# Altium schematic sheet ADC_Buffers.SchDoc
size A3
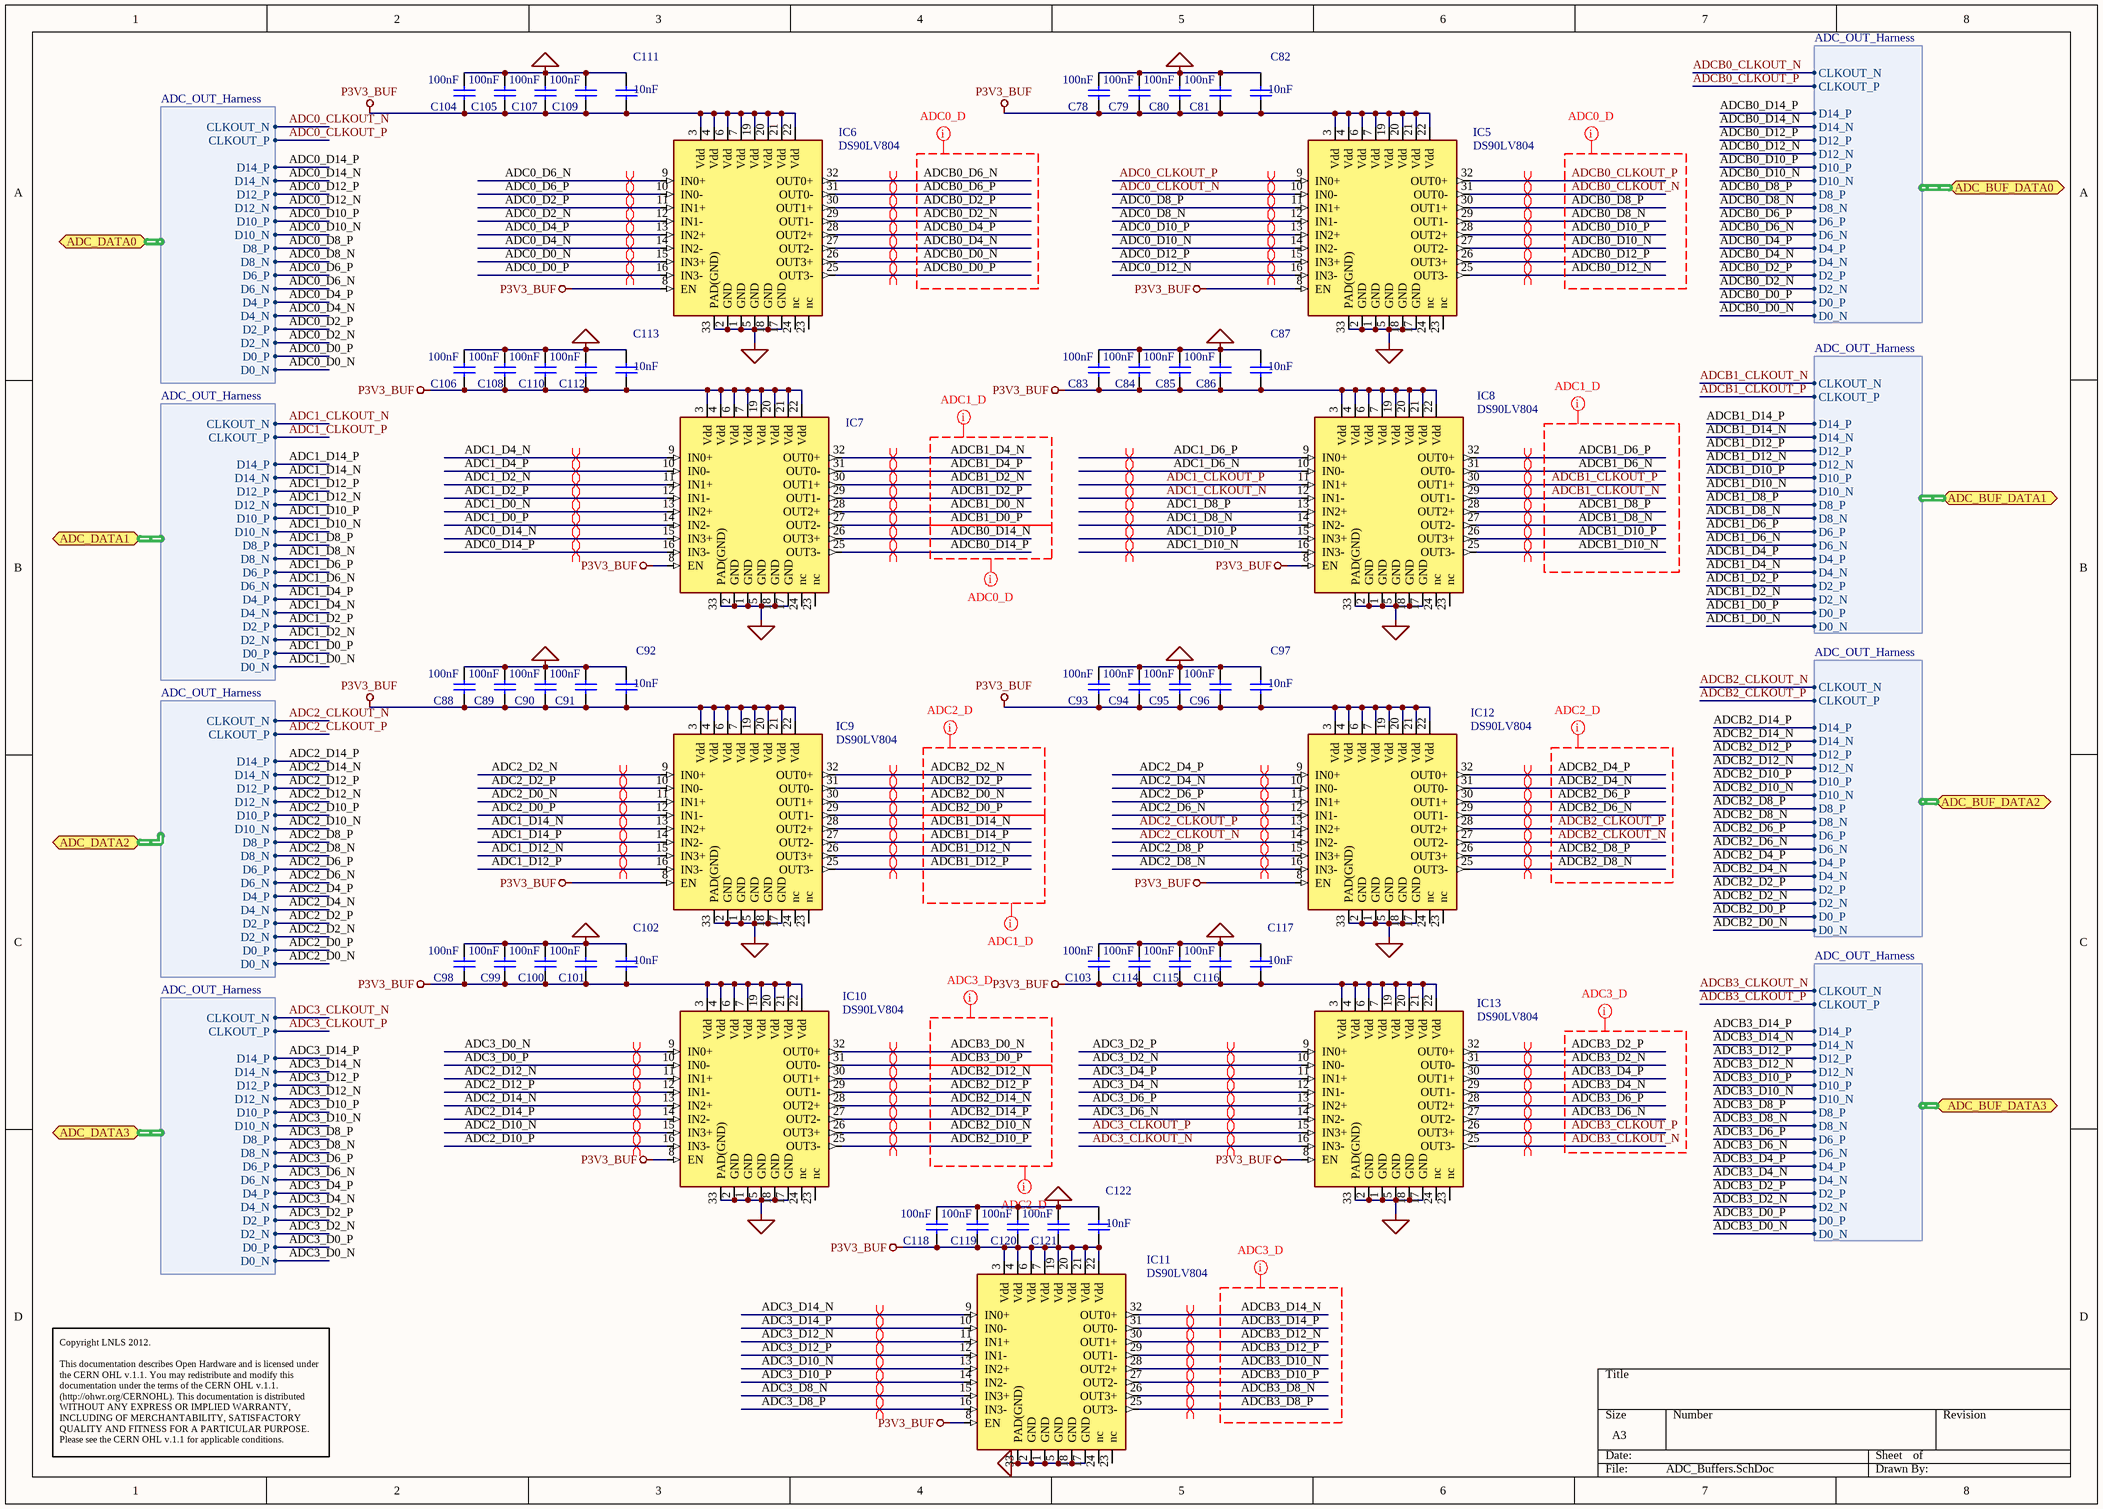
[diagram p0: ADC_Buffers.SchDoc]

## Parts
C78  100nF  [CAPC0603X33N]
C79  100nF  [CAPC0603X33N]
C80  100nF  [CAPC0603X33N]
C81  100nF  [CAPC0603X33N]
C82  10nF  [CAPC0603X33N]
C83  100nF  [CAPC0603X33N]
C84  100nF  [CAPC0603X33N]
C85  100nF  [CAPC0603X33N]
C86  100nF  [CAPC0603X33N]
C87  10nF  [CAPC0603X33N]
C88  100nF  [CAPC0603X33N]
C89  100nF  [CAPC0603X33N]
C90  100nF  [CAPC0603X33N]
C91  100nF  [CAPC0603X33N]
C92  10nF  [CAPC0603X33N]
C93  100nF  [CAPC0603X33N]
C94  100nF  [CAPC0603X33N]
C95  100nF  [CAPC0603X33N]
C96  100nF  [CAPC0603X33N]
C97  10nF  [CAPC0603X33N]
C98  100nF  [CAPC0603X33N]
C99  100nF  [CAPC0603X33N]
C100  100nF  [CAPC0603X33N]
C101  100nF  [CAPC0603X33N]
C102  10nF  [CAPC0603X33N]
C103  100nF  [CAPC0603X33N]
C104  100nF  [CAPC0603X33N]
C105  100nF  [CAPC0603X33N]
C106  100nF  [CAPC0603X33N]
C107  100nF  [CAPC0603X33N]
C108  100nF  [CAPC0603X33N]
C109  100nF  [CAPC0603X33N]
C110  100nF  [CAPC0603X33N]
C111  10nF  [CAPC0603X33N]
C112  100nF  [CAPC0603X33N]
C113  10nF  [CAPC0603X33N]
C114  100nF  [CAPC0603X33N]
C115  100nF  [CAPC0603X33N]
C116  100nF  [CAPC0603X33N]
C117  10nF  [CAPC0603X33N]
C118  100nF  [CAPC0603X33N]
C119  100nF  [CAPC0603X33N]
C120  100nF  [CAPC0603X33N]
C121  100nF  [CAPC0603X33N]
C122  10nF  [CAPC0603X33N]
IC5  DS90LV804  [QFN50P500X500X80-33N-S320]
IC6  DS90LV804  [QFN50P500X500X80-33N-S320]
IC7  DS90LV804  [QFN50P500X500X80-33N-S320]  (value not drawn)
IC8  DS90LV804  [QFN50P500X500X80-33N-S320]
IC9  DS90LV804  [QFN50P500X500X80-33N-S320]
IC10  DS90LV804  [QFN50P500X500X80-33N-S320]
IC11  DS90LV804  [QFN50P500X500X80-33N-S320]
IC12  DS90LV804  [QFN50P500X500X80-33N-S320]
IC13  DS90LV804  [QFN50P500X500X80-33N-S320]

## Ports
ADC_BUF_DATA0 (harness ADC_OUT_Harness), ADC_BUF_DATA1 (harness ADC_OUT_Harness), ADC_BUF_DATA2 (harness ADC_OUT_Harness), ADC_BUF_DATA3 (harness ADC_OUT_Harness), ADC_DATA0 (harness ADC_OUT_Harness), ADC_DATA1 (harness ADC_OUT_Harness), ADC_DATA2 (harness ADC_OUT_Harness), ADC_DATA3 (harness ADC_OUT_Harness)

## Harnesses
ADC_OUT_Harness: D14_P, D14_N, D12_P, D12_N, D10_P, D10_N, D8_P, D8_N, D6_P, D6_N, D4_P, D4_N, D2_P, D2_N, D0_P, D0_N, CLKOUT_N, CLKOUT_P

## Nets
GND: C78.1 C79.1 C80.1 C81.1 C82.1 C83.1 C84.1 C85.1 C86.1 C87.1 C88.1 C89.1 C90.1 C91.1 C92.1 C93.1 C94.1 C95.1 C96.1 C97.1 C98.1 C99.1 C100.1 C101.1 C102.1 C103.1 C104.1 C105.1 C106.1 C107.1 C108.1 C109.1 C110.1 C111.1 C112.1 C113.1 C114.1 C115.1 C116.1 C117.1 C118.1 C119.1 C120.1 C121.1 C122.1 IC5.1(GND) IC5.2(GND) IC5.5(GND) IC5.17(GND) IC5.18(GND) IC5.33(PAD(GND)) IC6.1(GND) IC6.2(GND) IC6.5(GND) IC6.17(GND) IC6.18(GND) IC6.33(PAD(GND)) IC7.1(GND) IC7.2(GND) IC7.5(GND) IC7.17(GND) IC7.18(GND) IC7.33(PAD(GND)) IC8.1(GND) IC8.2(GND) IC8.5(GND) IC8.17(GND) IC8.18(GND) IC8.33(PAD(GND)) IC9.1(GND) IC9.2(GND) IC9.5(GND) IC9.17(GND) IC9.18(GND) IC9.33(PAD(GND)) IC10.1(GND) IC10.2(GND) IC10.5(GND) IC10.17(GND) IC10.18(GND) IC10.33(PAD(GND)) IC11.1(GND) IC11.2(GND) IC11.5(GND) IC11.17(GND) IC11.18(GND) IC11.33(PAD(GND)) IC12.1(GND) IC12.2(GND) IC12.5(GND) IC12.17(GND) IC12.18(GND) IC12.33(PAD(GND)) IC13.1(GND) IC13.2(GND) IC13.5(GND) IC13.17(GND) IC13.18(GND) IC13.33(PAD(GND))
P3V3_BUF: C78.2 C79.2 C80.2 C81.2 C82.2 C83.2 C84.2 C85.2 C86.2 C87.2 C88.2 C89.2 C90.2 C91.2 C92.2 C93.2 C94.2 C95.2 C96.2 C97.2 C98.2 C99.2 C100.2 C101.2 C102.2 C103.2 C104.2 C105.2 C106.2 C107.2 C108.2 C109.2 C110.2 C111.2 C112.2 C113.2 C114.2 C115.2 C116.2 C117.2 C118.2 C119.2 C120.2 C121.2 C122.2 IC5.3(Vdd) IC5.4(Vdd) IC5.6(Vdd) IC5.7(Vdd) IC5.8(EN) IC5.19(Vdd) IC5.20(Vdd) IC5.21(Vdd) IC5.22(Vdd) IC6.3(Vdd) IC6.4(Vdd) IC6.6(Vdd) IC6.7(Vdd) IC6.8(EN) IC6.19(Vdd) IC6.20(Vdd) IC6.21(Vdd) IC6.22(Vdd) IC7.3(Vdd) IC7.4(Vdd) IC7.6(Vdd) IC7.7(Vdd) IC7.8(EN) IC7.19(Vdd) IC7.20(Vdd) IC7.21(Vdd) IC7.22(Vdd) IC8.3(Vdd) IC8.4(Vdd) IC8.6(Vdd) IC8.7(Vdd) IC8.8(EN) IC8.19(Vdd) IC8.20(Vdd) IC8.21(Vdd) IC8.22(Vdd) IC9.3(Vdd) IC9.4(Vdd) IC9.6(Vdd) IC9.7(Vdd) IC9.8(EN) IC9.19(Vdd) IC9.20(Vdd) IC9.21(Vdd) IC9.22(Vdd) IC10.3(Vdd) IC10.4(Vdd) IC10.6(Vdd) IC10.7(Vdd) IC10.8(EN) IC10.19(Vdd) IC10.20(Vdd) IC10.21(Vdd) IC10.22(Vdd) IC11.3(Vdd) IC11.4(Vdd) IC11.6(Vdd) IC11.7(Vdd) IC11.8(EN) IC11.19(Vdd) IC11.20(Vdd) IC11.21(Vdd) IC11.22(Vdd) IC12.3(Vdd) IC12.4(Vdd) IC12.6(Vdd) IC12.7(Vdd) IC12.8(EN) IC12.19(Vdd) IC12.20(Vdd) IC12.21(Vdd) IC12.22(Vdd) IC13.3(Vdd) IC13.4(Vdd) IC13.6(Vdd) IC13.7(Vdd) IC13.8(EN) IC13.19(Vdd) IC13.20(Vdd) IC13.21(Vdd) IC13.22(Vdd)
ADC0_CLKOUT_N: IC5.10(IN0-) ; port ADC_DATA0.CLKOUT_N
ADC0_CLKOUT_P: IC5.9(IN0+) ; port ADC_DATA0.CLKOUT_P
ADC0_D0_N: IC6.15(IN3+) ; port ADC_DATA0.D0_N
ADC0_D0_P: IC6.16(IN3-) ; port ADC_DATA0.D0_P
ADC0_D2_N: IC6.12(IN1-) ; port ADC_DATA0.D2_N
ADC0_D2_P: IC6.11(IN1+) ; port ADC_DATA0.D2_P
ADC0_D4_N: IC6.14(IN2-) ; port ADC_DATA0.D4_N
ADC0_D4_P: IC6.13(IN2+) ; port ADC_DATA0.D4_P
ADC0_D6_N: IC6.9(IN0+) ; port ADC_DATA0.D6_N
ADC0_D6_P: IC6.10(IN0-) ; port ADC_DATA0.D6_P
ADC0_D8_N: IC5.12(IN1-) ; port ADC_DATA0.D8_N
ADC0_D8_P: IC5.11(IN1+) ; port ADC_DATA0.D8_P
ADC0_D10_N: IC5.14(IN2-) ; port ADC_DATA0.D10_N
ADC0_D10_P: IC5.13(IN2+) ; port ADC_DATA0.D10_P
ADC0_D12_N: IC5.16(IN3-) ; port ADC_DATA0.D12_N
ADC0_D12_P: IC5.15(IN3+) ; port ADC_DATA0.D12_P
ADC0_D14_N: IC7.15(IN3+) ; port ADC_DATA0.D14_N
ADC0_D14_P: IC7.16(IN3-) ; port ADC_DATA0.D14_P
ADC1_CLKOUT_N: IC8.12(IN1-) ; port ADC_DATA1.CLKOUT_N
ADC1_CLKOUT_P: IC8.11(IN1+) ; port ADC_DATA1.CLKOUT_P
ADC1_D0_N: IC7.13(IN2+) ; port ADC_DATA1.D0_N
ADC1_D0_P: IC7.14(IN2-) ; port ADC_DATA1.D0_P
ADC1_D2_N: IC7.11(IN1+) ; port ADC_DATA1.D2_N
ADC1_D2_P: IC7.12(IN1-) ; port ADC_DATA1.D2_P
ADC1_D4_N: IC7.9(IN0+) ; port ADC_DATA1.D4_N
ADC1_D4_P: IC7.10(IN0-) ; port ADC_DATA1.D4_P
ADC1_D6_N: IC8.10(IN0-) ; port ADC_DATA1.D6_N
ADC1_D6_P: IC8.9(IN0+) ; port ADC_DATA1.D6_P
ADC1_D8_N: IC8.14(IN2-) ; port ADC_DATA1.D8_N
ADC1_D8_P: IC8.13(IN2+) ; port ADC_DATA1.D8_P
ADC1_D10_N: IC8.16(IN3-) ; port ADC_DATA1.D10_N
ADC1_D10_P: IC8.15(IN3+) ; port ADC_DATA1.D10_P
ADC1_D12_N: IC9.15(IN3+) ; port ADC_DATA1.D12_N
ADC1_D12_P: IC9.16(IN3-) ; port ADC_DATA1.D12_P
ADC1_D14_N: IC9.13(IN2+) ; port ADC_DATA1.D14_N
ADC1_D14_P: IC9.14(IN2-) ; port ADC_DATA1.D14_P
ADC2_CLKOUT_N: IC12.14(IN2-) ; port ADC_DATA2.CLKOUT_N
ADC2_CLKOUT_P: IC12.13(IN2+) ; port ADC_DATA2.CLKOUT_P
ADC2_D0_N: IC9.11(IN1+) ; port ADC_DATA2.D0_N
ADC2_D0_P: IC9.12(IN1-) ; port ADC_DATA2.D0_P
ADC2_D2_N: IC9.9(IN0+) ; port ADC_DATA2.D2_N
ADC2_D2_P: IC9.10(IN0-) ; port ADC_DATA2.D2_P
ADC2_D4_N: IC12.10(IN0-) ; port ADC_DATA2.D4_N
ADC2_D4_P: IC12.9(IN0+) ; port ADC_DATA2.D4_P
ADC2_D6_N: IC12.12(IN1-) ; port ADC_DATA2.D6_N
ADC2_D6_P: IC12.11(IN1+) ; port ADC_DATA2.D6_P
ADC2_D8_N: IC12.16(IN3-) ; port ADC_DATA2.D8_N
ADC2_D8_P: IC12.15(IN3+) ; port ADC_DATA2.D8_P
ADC2_D10_N: IC10.15(IN3+) ; port ADC_DATA2.D10_N
ADC2_D10_P: IC10.16(IN3-) ; port ADC_DATA2.D10_P
ADC2_D12_N: IC10.11(IN1+) ; port ADC_DATA2.D12_N
ADC2_D12_P: IC10.12(IN1-) ; port ADC_DATA2.D12_P
ADC2_D14_N: IC10.13(IN2+) ; port ADC_DATA2.D14_N
ADC2_D14_P: IC10.14(IN2-) ; port ADC_DATA2.D14_P
ADC3_CLKOUT_N: IC13.16(IN3-) ; port ADC_DATA3.CLKOUT_N
ADC3_CLKOUT_P: IC13.15(IN3+) ; port ADC_DATA3.CLKOUT_P
ADC3_D0_N: IC10.9(IN0+) ; port ADC_DATA3.D0_N
ADC3_D0_P: IC10.10(IN0-) ; port ADC_DATA3.D0_P
ADC3_D2_N: IC13.10(IN0-) ; port ADC_DATA3.D2_N
ADC3_D2_P: IC13.9(IN0+) ; port ADC_DATA3.D2_P
ADC3_D4_N: IC13.12(IN1-) ; port ADC_DATA3.D4_N
ADC3_D4_P: IC13.11(IN1+) ; port ADC_DATA3.D4_P
ADC3_D6_N: IC13.14(IN2-) ; port ADC_DATA3.D6_N
ADC3_D6_P: IC13.13(IN2+) ; port ADC_DATA3.D6_P
ADC3_D8_N: IC11.15(IN3+) ; port ADC_DATA3.D8_N
ADC3_D8_P: IC11.16(IN3-) ; port ADC_DATA3.D8_P
ADC3_D10_N: IC11.13(IN2+) ; port ADC_DATA3.D10_N
ADC3_D10_P: IC11.14(IN2-) ; port ADC_DATA3.D10_P
ADC3_D12_N: IC11.11(IN1+) ; port ADC_DATA3.D12_N
ADC3_D12_P: IC11.12(IN1-) ; port ADC_DATA3.D12_P
ADC3_D14_N: IC11.9(IN0+) ; port ADC_DATA3.D14_N
ADC3_D14_P: IC11.10(IN0-) ; port ADC_DATA3.D14_P
ADCB0_CLKOUT_N: IC5.31(OUT0-) ; port ADC_BUF_DATA0.CLKOUT_N
ADCB0_CLKOUT_P: IC5.32(OUT0+) ; port ADC_BUF_DATA0.CLKOUT_P
ADCB0_D0_N: IC6.26(OUT3+) ; port ADC_BUF_DATA0.D0_N
ADCB0_D0_P: IC6.25(OUT3-) ; port ADC_BUF_DATA0.D0_P
ADCB0_D2_N: IC6.29(OUT1-) ; port ADC_BUF_DATA0.D2_N
ADCB0_D2_P: IC6.30(OUT1+) ; port ADC_BUF_DATA0.D2_P
ADCB0_D4_N: IC6.27(OUT2-) ; port ADC_BUF_DATA0.D4_N
ADCB0_D4_P: IC6.28(OUT2+) ; port ADC_BUF_DATA0.D4_P
ADCB0_D6_N: IC6.32(OUT0+) ; port ADC_BUF_DATA0.D6_N
ADCB0_D6_P: IC6.31(OUT0-) ; port ADC_BUF_DATA0.D6_P
ADCB0_D8_N: IC5.29(OUT1-) ; port ADC_BUF_DATA0.D8_N
ADCB0_D8_P: IC5.30(OUT1+) ; port ADC_BUF_DATA0.D8_P
ADCB0_D10_N: IC5.27(OUT2-) ; port ADC_BUF_DATA0.D10_N
ADCB0_D10_P: IC5.28(OUT2+) ; port ADC_BUF_DATA0.D10_P
ADCB0_D12_N: IC5.25(OUT3-) ; port ADC_BUF_DATA0.D12_N
ADCB0_D12_P: IC5.26(OUT3+) ; port ADC_BUF_DATA0.D12_P
ADCB0_D14_N: IC7.26(OUT3+) ; port ADC_BUF_DATA0.D14_N
ADCB0_D14_P: IC7.25(OUT3-) ; port ADC_BUF_DATA0.D14_P
ADCB1_CLKOUT_N: IC8.29(OUT1-) ; port ADC_BUF_DATA1.CLKOUT_N
ADCB1_CLKOUT_P: IC8.30(OUT1+) ; port ADC_BUF_DATA1.CLKOUT_P
ADCB1_D0_N: IC7.28(OUT2+) ; port ADC_BUF_DATA1.D0_N
ADCB1_D0_P: IC7.27(OUT2-) ; port ADC_BUF_DATA1.D0_P
ADCB1_D2_N: IC7.30(OUT1+) ; port ADC_BUF_DATA1.D2_N
ADCB1_D2_P: IC7.29(OUT1-) ; port ADC_BUF_DATA1.D2_P
ADCB1_D4_N: IC7.32(OUT0+) ; port ADC_BUF_DATA1.D4_N
ADCB1_D4_P: IC7.31(OUT0-) ; port ADC_BUF_DATA1.D4_P
ADCB1_D6_N: IC8.31(OUT0-) ; port ADC_BUF_DATA1.D6_N
ADCB1_D6_P: IC8.32(OUT0+) ; port ADC_BUF_DATA1.D6_P
ADCB1_D8_N: IC8.27(OUT2-) ; port ADC_BUF_DATA1.D8_N
ADCB1_D8_P: IC8.28(OUT2+) ; port ADC_BUF_DATA1.D8_P
ADCB1_D10_N: IC8.25(OUT3-) ; port ADC_BUF_DATA1.D10_N
ADCB1_D10_P: IC8.26(OUT3+) ; port ADC_BUF_DATA1.D10_P
ADCB1_D12_N: IC9.26(OUT3+) ; port ADC_BUF_DATA1.D12_N
ADCB1_D12_P: IC9.25(OUT3-) ; port ADC_BUF_DATA1.D12_P
ADCB1_D14_N: IC9.28(OUT2+) ; port ADC_BUF_DATA1.D14_N
ADCB1_D14_P: IC9.27(OUT2-) ; port ADC_BUF_DATA1.D14_P
ADCB2_CLKOUT_N: IC12.27(OUT2-) ; port ADC_BUF_DATA2.CLKOUT_N
ADCB2_CLKOUT_P: IC12.28(OUT2+) ; port ADC_BUF_DATA2.CLKOUT_P
ADCB2_D0_N: IC9.30(OUT1+) ; port ADC_BUF_DATA2.D0_N
ADCB2_D0_P: IC9.29(OUT1-) ; port ADC_BUF_DATA2.D0_P
ADCB2_D2_N: IC9.32(OUT0+) ; port ADC_BUF_DATA2.D2_N
ADCB2_D2_P: IC9.31(OUT0-) ; port ADC_BUF_DATA2.D2_P
ADCB2_D4_N: IC12.31(OUT0-) ; port ADC_BUF_DATA2.D4_N
ADCB2_D4_P: IC12.32(OUT0+) ; port ADC_BUF_DATA2.D4_P
ADCB2_D6_N: IC12.29(OUT1-) ; port ADC_BUF_DATA2.D6_N
ADCB2_D6_P: IC12.30(OUT1+) ; port ADC_BUF_DATA2.D6_P
ADCB2_D8_N: IC12.25(OUT3-) ; port ADC_BUF_DATA2.D8_N
ADCB2_D8_P: IC12.26(OUT3+) ; port ADC_BUF_DATA2.D8_P
ADCB2_D10_N: IC10.26(OUT3+) ; port ADC_BUF_DATA2.D10_N
ADCB2_D10_P: IC10.25(OUT3-) ; port ADC_BUF_DATA2.D10_P
ADCB2_D12_N: IC10.30(OUT1+) ; port ADC_BUF_DATA2.D12_N
ADCB2_D12_P: IC10.29(OUT1-) ; port ADC_BUF_DATA2.D12_P
ADCB2_D14_N: IC10.28(OUT2+) ; port ADC_BUF_DATA2.D14_N
ADCB2_D14_P: IC10.27(OUT2-) ; port ADC_BUF_DATA2.D14_P
ADCB3_CLKOUT_N: IC13.25(OUT3-) ; port ADC_BUF_DATA3.CLKOUT_N
ADCB3_CLKOUT_P: IC13.26(OUT3+) ; port ADC_BUF_DATA3.CLKOUT_P
ADCB3_D0_N: IC10.32(OUT0+) ; port ADC_BUF_DATA3.D0_N
ADCB3_D0_P: IC10.31(OUT0-) ; port ADC_BUF_DATA3.D0_P
ADCB3_D2_N: IC13.31(OUT0-) ; port ADC_BUF_DATA3.D2_N
ADCB3_D2_P: IC13.32(OUT0+) ; port ADC_BUF_DATA3.D2_P
ADCB3_D4_N: IC13.29(OUT1-) ; port ADC_BUF_DATA3.D4_N
ADCB3_D4_P: IC13.30(OUT1+) ; port ADC_BUF_DATA3.D4_P
ADCB3_D6_N: IC13.27(OUT2-) ; port ADC_BUF_DATA3.D6_N
ADCB3_D6_P: IC13.28(OUT2+) ; port ADC_BUF_DATA3.D6_P
ADCB3_D8_N: IC11.26(OUT3+) ; port ADC_BUF_DATA3.D8_N
ADCB3_D8_P: IC11.25(OUT3-) ; port ADC_BUF_DATA3.D8_P
ADCB3_D10_N: IC11.28(OUT2+) ; port ADC_BUF_DATA3.D10_N
ADCB3_D10_P: IC11.27(OUT2-) ; port ADC_BUF_DATA3.D10_P
ADCB3_D12_N: IC11.30(OUT1+) ; port ADC_BUF_DATA3.D12_N
ADCB3_D12_P: IC11.29(OUT1-) ; port ADC_BUF_DATA3.D12_P
ADCB3_D14_N: IC11.32(OUT0+) ; port ADC_BUF_DATA3.D14_N
ADCB3_D14_P: IC11.31(OUT0-) ; port ADC_BUF_DATA3.D14_P

Not connected (* = marked no-connect by the designer): IC5 23(nc) 24(nc); IC6 23(nc) 24(nc); IC7 23(nc) 24(nc); IC8 23(nc) 24(nc); IC9 23(nc) 24(nc); IC10 23(nc) 24(nc); IC11 23(nc) 24(nc); IC12 23(nc) 24(nc); IC13 23(nc) 24(nc)

## Layout directives
differential pair: ADC0_CLKOUT_N, ADC0_CLKOUT_P, ADC0_D0_N, ADC0_D0_P, ADC0_D2_N, ADC0_D2_P, ADC0_D4_N, ADC0_D4_P, ADC0_D6_N, ADC0_D6_P, ADC0_D8_N, ADC0_D8_P, ADC0_D10_N, ADC0_D10_P, ADC0_D12_N, ADC0_D12_P, ADC0_D14_N, ADC0_D14_P, ADC1_CLKOUT_N, ADC1_CLKOUT_P, ADC1_D0_N, ADC1_D0_P, ADC1_D2_N, ADC1_D2_P, ADC1_D4_N, ADC1_D4_P, ADC1_D6_N, ADC1_D6_P, ADC1_D8_N, ADC1_D8_P, ADC1_D10_N, ADC1_D10_P, ADC1_D12_N, ADC1_D12_P, ADC1_D14_N, ADC1_D14_P, ADC2_CLKOUT_N, ADC2_CLKOUT_P, ADC2_D0_N, ADC2_D0_P, ADC2_D2_N, ADC2_D2_P, ADC2_D4_N, ADC2_D4_P, ADC2_D6_N, ADC2_D6_P, ADC2_D8_N, ADC2_D8_P, ADC2_D10_N, ADC2_D10_P, ADC2_D12_N, ADC2_D12_P, ADC2_D14_N, ADC2_D14_P, ADC3_CLKOUT_N, ADC3_CLKOUT_P, ADC3_D0_N, ADC3_D0_P, ADC3_D2_N, ADC3_D2_P, ADC3_D4_N, ADC3_D4_P, ADC3_D6_N, ADC3_D6_P, ADC3_D8_N, ADC3_D8_P, ADC3_D10_N, ADC3_D10_P, ADC3_D12_N, ADC3_D12_P, ADC3_D14_N, ADC3_D14_P, ADCB0_CLKOUT_N, ADCB0_CLKOUT_P, ADCB0_D0_N, ADCB0_D0_P, ADCB0_D2_N, ADCB0_D2_P, ADCB0_D4_N, ADCB0_D4_P, ADCB0_D6_N, ADCB0_D6_P, ADCB0_D8_N, ADCB0_D8_P, ADCB0_D10_N, ADCB0_D10_P, ADCB0_D12_N, ADCB0_D12_P, ADCB0_D14_N, ADCB0_D14_P, ADCB1_CLKOUT_N, ADCB1_CLKOUT_P, ADCB1_D0_N, ADCB1_D0_P, ADCB1_D2_N, ADCB1_D2_P, ADCB1_D4_N, ADCB1_D4_P, ADCB1_D6_N, ADCB1_D6_P, ADCB1_D8_N, ADCB1_D8_P, ADCB1_D10_N, ADCB1_D10_P, ADCB1_D12_N, ADCB1_D12_P, ADCB1_D14_N, ADCB1_D14_P, ADCB2_CLKOUT_N, ADCB2_CLKOUT_P, ADCB2_D0_N, ADCB2_D0_P, ADCB2_D2_N, ADCB2_D2_P, ADCB2_D4_N, ADCB2_D4_P, ADCB2_D6_N, ADCB2_D6_P, ADCB2_D8_N, ADCB2_D8_P, ADCB2_D10_N, ADCB2_D10_P, ADCB2_D12_N, ADCB2_D12_P, ADCB2_D14_N, ADCB2_D14_P, ADCB3_CLKOUT_N, ADCB3_CLKOUT_P, ADCB3_D0_N, ADCB3_D0_P, ADCB3_D2_N, ADCB3_D2_P, ADCB3_D4_N, ADCB3_D4_P, ADCB3_D6_N, ADCB3_D6_P, ADCB3_D8_N, ADCB3_D8_P, ADCB3_D10_N, ADCB3_D10_P, ADCB3_D12_N, ADCB3_D12_P, ADCB3_D14_N, ADCB3_D14_P
net class ADC2_D: ADCB2_CLKOUT_N, ADCB2_CLKOUT_P, ADCB2_D0_N, ADCB2_D0_P, ADCB2_D2_N, ADCB2_D2_P, ADCB2_D4_N, ADCB2_D4_P, ADCB2_D6_N, ADCB2_D6_P, ADCB2_D8_N, ADCB2_D8_P, ADCB2_D10_N, ADCB2_D10_P, ADCB2_D12_N, ADCB2_D12_P, ADCB2_D14_N, ADCB2_D14_P, ADCB3_D0_P
net class ADC0_D: ADCB0_CLKOUT_N, ADCB0_CLKOUT_P, ADCB0_D0_N, ADCB0_D0_P, ADCB0_D2_N, ADCB0_D2_P, ADCB0_D4_N, ADCB0_D4_P, ADCB0_D6_N, ADCB0_D6_P, ADCB0_D8_N, ADCB0_D8_P, ADCB0_D10_N, ADCB0_D10_P, ADCB0_D12_N, ADCB0_D12_P, ADCB0_D14_N, ADCB0_D14_P, ADCB1_D0_P
net class ADC1_D: ADCB1_CLKOUT_N, ADCB1_CLKOUT_P, ADCB1_D0_N, ADCB1_D0_P, ADCB1_D2_N, ADCB1_D2_P, ADCB1_D4_N, ADCB1_D4_P, ADCB1_D6_N, ADCB1_D6_P, ADCB1_D8_N, ADCB1_D8_P, ADCB1_D10_N, ADCB1_D10_P, ADCB1_D12_N, ADCB1_D12_P, ADCB1_D14_N, ADCB1_D14_P, ADCB2_D0_P
net class ADC3_D: ADCB3_CLKOUT_N, ADCB3_CLKOUT_P, ADCB3_D0_N, ADCB3_D0_P, ADCB3_D2_N, ADCB3_D2_P, ADCB3_D4_N, ADCB3_D4_P, ADCB3_D6_N, ADCB3_D6_P, ADCB3_D8_N, ADCB3_D8_P, ADCB3_D10_N, ADCB3_D10_P, ADCB3_D12_N, ADCB3_D12_P, ADCB3_D14_N, ADCB3_D14_P

## Notes on the sheet
- Copyright LNLS 2012.
  This documentation describes Open Hardware and is licensed under the CERN OHL v.1.1. You may redistribute and modify this documentation under the terms of the CERN OHL v.1.1. (http://ohwr.org/CERNOHL). This documentation is distributed WITHOUT ANY EXPRESS OR IMPLIED WARRANTY, INCLUDING OF MERCHANTABILITY, SATISFACTORY QUALITY AND FITNESS FOR A PARTICULAR PURPOSE. Please see the CERN OHL v.1.1 for applicable conditions.

## Library data of the parts
C78-C81 C83-C86 C88-C91 C93-C96 C98-C101 C103-C110 C112 C114-C116 C118-C121 = CC0201_100NF_6.3V_10%_X5R: Non-polarised capacitor; Part Description: SMD Multilayer Chip Ceramic Capacitor; Manufacturer: GENERIC; Manufacturer1 Part Number: 02016D104KAT2A; Voltage: 6.3V; TC: X5R; Tolerance: ±10%; Table: Capacitors SMD; Value: 100nF; Part Number: CC0201_100NF_6.3V_10%_X5R; Component Kind: Standard; Component Type: Standard; Pin Count: 2; Status: Not Recommended; Manufacturer Part Number: CC0201_100NF_6.3V_10%_X5R; Case: 0201; Mounted: Yes; Socket: No; SMD: Yes; Manufacturer1 Example: AVX; Manufacturer1 ComponentHeight: 0.33mm; HelpURL: \\cern.ch\dfs\Applications\Altium\Datasheets\CC0201_X5R_AVX.pdf; Author: CERN DEM JLC; CreateDate: 03/12/2007; LatestRevisionDate: 03/12/2007; Sense: No
C82 C87 C92 C97 C102 C111 C113 C117 C122 = CC0201_10NF_10V_10%_X7R: Non-polarised capacitor; Part Description: SMD Multilayer Chip Ceramic Capacitor; Manufacturer: GENERIC; Manufacturer1 Part Number: GRM033R71A103KA01D; Voltage: 10V; TC: X7R; Tolerance: ±10%; Value: 10nF; Part Number: CC0201_10NF_10V_10%_X7R; Component Kind: Standard; Component Type: Standard; Pin Count: 2; Status: Not Recommended; Manufacturer Part Number: CC0201_10NF_10V_10%_X7R; Case: 0201; Mounted: Yes; Socket: No; SMD: Yes; Manufacturer1 Example: Murata; Manufacturer1 ComponentHeight: 0.33mm; Author: LNLS DIG GBMB; CreateDate: 14/06/2016; LatestRevisionDate: 14/06/2016; Sense: No
IC5 IC6 = DS90LV804TSQ: 4-Channel 800 Mbps LVDS Buffer/Repeater; Manufacturer: TEXAS INSTRUMENTS; Bonding: No; PressFit: No; Part Number: DS90LV804TSQ; Author: LNLS DIG GBMB; Case: QFN32; ComponentHeight: 0.8mm; Component Type: Standard; CreateDate: 01/06/2016; Device: DS90LV804; LatestRevisionDate: 01/06/2016; Manufacturer Part Number: DS90LV804TSQ; Mounted: Yes; PackageDescription: QFN, 0.50mm Pitch, Square; 8 Pin X 8 Pin, 5mm X 5mm X 0.8mm H Body (w/Thermal Tab 3.2 X 3.2mm),  IPC Medium Density; Part Description: 4-Channel 800Mbps LVDS Buffer/Repeater; Pin Count: 33; Sense: No; SMD: Yes; Socket: No; Component Kind: Standard
IC7-IC13 = DS90LV804TSQ: 4-Channel 800 Mbps LVDS Buffer/Repeater; Manufacturer: TEXAS INSTRUMENTS; PressFit: No; Bonding: No; Part Number: DS90LV804TSQ; Component Kind: Standard; Component Type: Standard; Device: DS90LV804; PackageDescription: QFN, 0.50mm Pitch, Square; 8 Pin X 8 Pin, 5mm X 5mm X 0.8mm H Body (w/Thermal Tab 3.2 X 3.2mm),  IPC Medium Density; Part Description: 4-Channel 800Mbps LVDS Buffer/Repeater; Manufacturer Part Number: DS90LV804TSQ; Pin Count: 33; Case: QFN32; Mounted: Yes; Socket: No; SMD: Yes; Sense: No; ComponentHeight: 0.8mm; Author: LNLS DIG GBMB; CreateDate: 01/06/2016; LatestRevisionDate: 01/06/2016